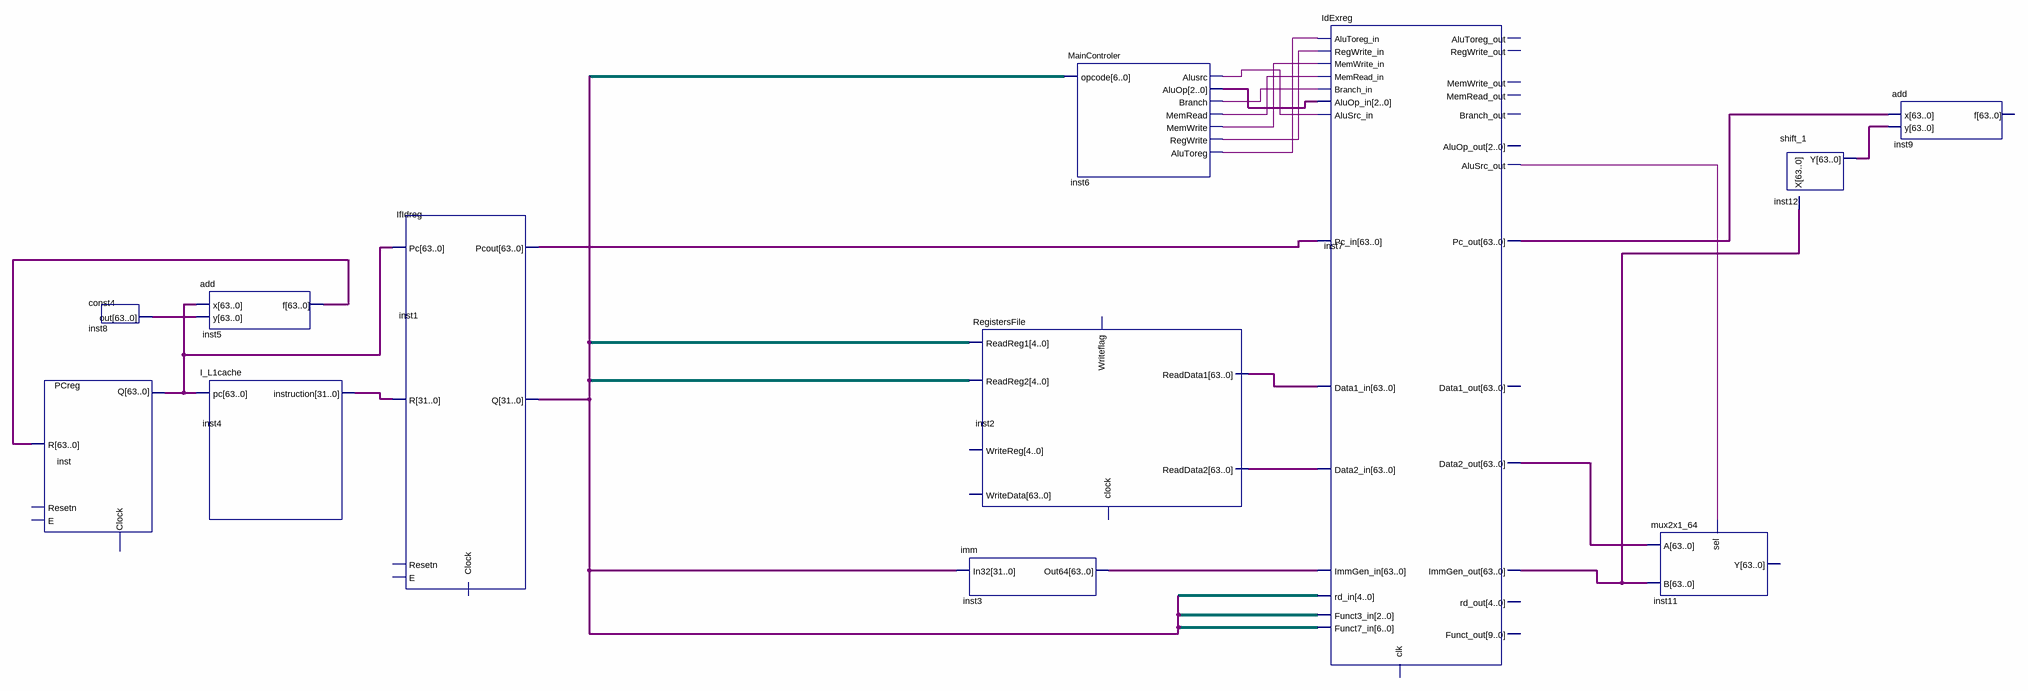
[diagram p0: schematic sheet]
// Quartus schematic General_Purpose_core.bdf as structural Verilog: 12 symbols, 0 pins
module General_Purpose_core (
);

  wire inst6_alusrc, inst6_alutoreg, inst6_branch, inst6_memread, inst6_memwrite, inst6_regwrite,
       inst7_alusrc_out;
  wire [2:0] inst6_aluop;
  wire [31:0] inst1_q, inst4_instruction;
  wire [63:0] inst1_pcout, inst2_readdata1, inst2_readdata2, inst3_out64, inst5_f, inst7_data2_out,
       inst7_immgen_out, inst7_pc_out, inst8_out, inst12_y, inst_q;

  PCreg inst (.R(inst5_f), .Q(inst_q));  // open: Clock, Resetn, E
  const4 inst8 (.out(inst8_out));
  add inst5 (.x(inst_q), .y(inst8_out), .f(inst5_f));
  I_L1cache inst4 (.pc(inst_q), .instruction(inst4_instruction));
  IfIdreg inst1 (.R(inst4_instruction), .Pc(inst_q), .Q(inst1_q), .Pcout(inst1_pcout));  // open: Clock, Resetn, E
  RegistersFile inst2 (
    .ReadData1(inst2_readdata1), .ReadData2(inst2_readdata2));  // open: ReadReg1, ReadReg2, WriteReg, WriteData, Writeflag, clock
  imm inst3 (.In32(inst1_q), .Out64(inst3_out64));
  MainControler inst6 (
    .Alusrc(inst6_alusrc), .AluOp(inst6_aluop), .Branch(inst6_branch), .MemRead(inst6_memread),
    .MemWrite(inst6_memwrite), .RegWrite(inst6_regwrite), .AluToreg(inst6_alutoreg));  // open: opcode
  IdExreg inst7 (
    .AluToreg_in(inst6_alutoreg), .RegWrite_in(inst6_regwrite), .MemWrite_in(inst6_memwrite),
    .MemRead_in(inst6_memread), .Branch_in(inst6_branch), .AluOp_in(inst6_aluop), .AluSrc_in(inst6_alusrc),
    .Pc_in(inst1_pcout), .Data1_in(inst2_readdata1), .Data2_in(inst2_readdata2), .ImmGen_in(inst3_out64),
    .AluSrc_out(inst7_alusrc_out), .Pc_out(inst7_pc_out), .Data2_out(inst7_data2_out),
    .ImmGen_out(inst7_immgen_out));  // open: rd_in, Funct3_in, Funct7_in, clk, AluToreg_out, RegWrite_out, MemWrite_out, MemRead_out, Branch_out, AluOp_out, Data1_out, rd_out, Funct_out
  mux2x1_64 inst11 (.A(inst7_data2_out), .B(inst7_immgen_out), .sel(inst7_alusrc_out));  // open: Y
  shift_1 inst12 (.X(inst7_immgen_out), .Y(inst12_y));
  add inst9 (.x(inst7_pc_out), .y(inst12_y));  // open: f
endmodule
